# Altium schematic sheet WCcircuit.SchDoc
size A4
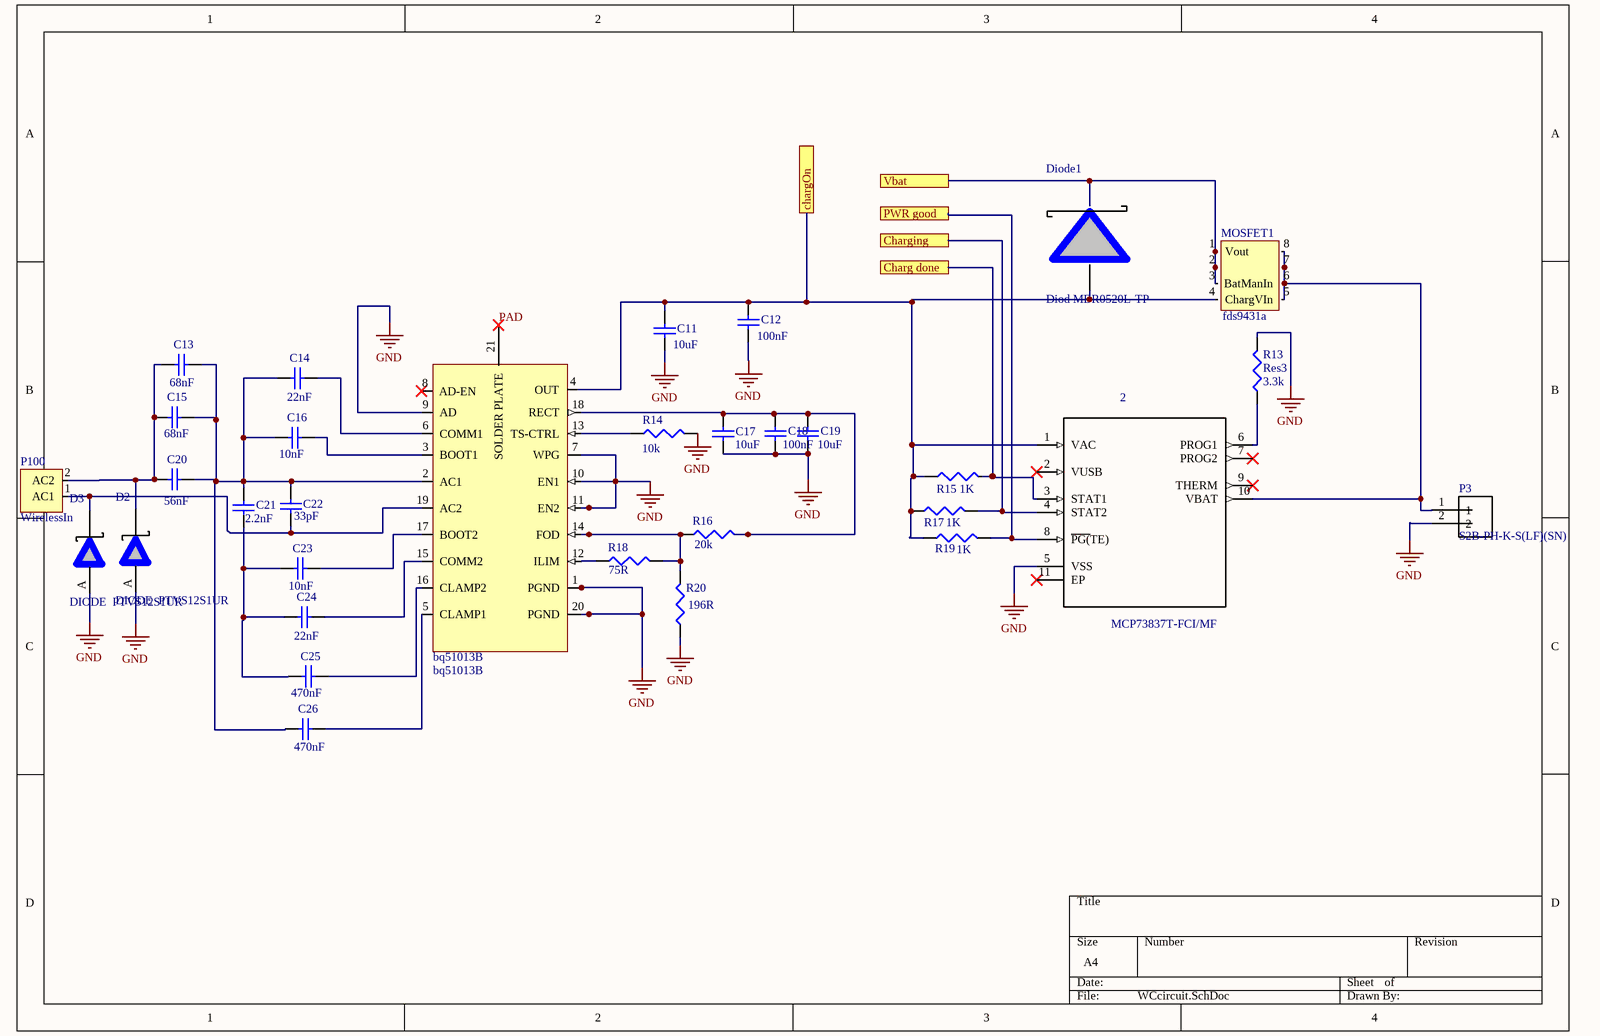
[diagram p0: WCcircuit.SchDoc]

## Parts
2  MCP73837T-FCI/MF  [DFN300X300X100-11N]
bq51013B  bq51013B  [CONTROLLER_MSP430FR2522IRHLT]
C11  value 10uF  [1608[0603]]  (hidden comment: Cap Semi)
C12  value 100nF  [1608[0603]]  (hidden comment: Cap Semi)
C13  value 68nF  [1608[0603]]  (hidden comment: Cap Semi)
C14  value 22nF  [1608[0603]]  (hidden comment: Cap Semi)
C15  value 68nF  [1608[0603]]  (hidden comment: Cap Semi)
C16  value 10nF  [1608[0603]]  (hidden comment: Cap Semi)
C17  value 10uF  [1608[0603]]  (hidden comment: Cap Semi)
C18  value 100nF  [1608[0603]]  (hidden comment: Cap Semi)
C19  value 10uF  [1608[0603]]  (hidden comment: Cap Semi)
C20  value 56nF  [1608[0603]]  (hidden comment: Cap Semi)
C21  value 2.2nF  [1608[0603]]  (hidden comment: Cap Semi)
C22  value 33pF  [1608[0603]]  (hidden comment: Cap Semi)
C23  value 10nF  [1608[0603]]  (hidden comment: Cap Semi)
C24  value 22nF  [1608[0603]]  (hidden comment: Cap Semi)
C25  value 470nF  [1608[0603]]  (hidden comment: Cap Semi)
C26  value 470nF  [1608[0603]]  (hidden comment: Cap Semi)
D2  DIODE  PTVS12S1UR  [PTVS12S1UR]
D3  DIODE  PTVS12S1UR  [PTVS12S1UR]
Diode1  Diod MBR0520L-TP  [SOD3716X135N]
MOSFET1  fds9431a  [SOIC127P600X175-8N]
P3  S2B-PH-K-S(LF)(SN)  [JST_S2B-PH-K-S(LF)(SN)]
P100  WirelessIn  [WirelessIn]
R13  Res3  value 3.3k  [J1-0603]
R14  value 10k  [J1-0603]  (hidden comment: Res3)
R15  value 1K  [J1-0603]  (hidden comment: Res3)
R16  value 20k  [J1-0603]  (hidden comment: Res3)
R17  value 1K  [J1-0603]  (hidden comment: Res3)
R18  value 75R  [J1-0603]  (hidden comment: Res3)
R19  value 1K  [J1-0603]  (hidden comment: Res3)
R20  value 196R  [J1-0603]  (hidden comment: Res3)

## Ports
Charg done, Charging, chargOn, PWR good, Vbat

## Nets
GND: 2.5(VSS) bq51013B.1(PGND) bq51013B.7(WPG) bq51013B.9(AD) bq51013B.10(EN1) bq51013B.11(EN2) bq51013B.20(PGND) C11.1 C12.1 C17.1 C18.1 C19.1 D2.A D3.A P3.2 R13.2 R14.2 R20.1
Charg done: 2.3(STAT1) R15.2 ; port Charg done
Charging: 2.4(STAT2) R17.2 ; port Charging
chargOn: 2.1(VAC) bq51013B.4(OUT) C11.2 C12.2 Diode1.A MOSFET1.4(ChargVIn) R15.1 R17.1 R19.1 ; port chargOn
PAD: bq51013B.21(SOLDER_PLATE)
PWR good: 2.8(~{PG(}TE)) R19.2 ; port PWR good
Vbat: Diode1.C MOSFET1.1(Vout) MOSFET1.2 MOSFET1.3 ; port Vbat
Net2_6: 2.6(PROG1) R13.1
Net2_10: 2.10(VBAT) MOSFET1.5 MOSFET1.6(BatManIn) MOSFET1.7 MOSFET1.8 P3.1
Netbq51013B_2: bq51013B.2(AC1) C13.2 C14.1 C15.2 C16.1 C20.2 C21.2 C22.2 C26.1
Netbq51013B_3: bq51013B.3(BOOT1) C16.2
Netbq51013B_5: bq51013B.5(CLAMP1) C26.2
Netbq51013B_6: bq51013B.6(COMM1) C14.2
Netbq51013B_12: bq51013B.12(ILIM) R18.1
Netbq51013B_13: bq51013B.13(TS-CTRL) R14.1
Netbq51013B_14: bq51013B.14(FOD) R16.1 R18.2 R20.2
Netbq51013B_15: bq51013B.15(COMM2) C24.2
Netbq51013B_16: bq51013B.16(CLAMP2) C25.2
Netbq51013B_17: bq51013B.17(BOOT2) C23.2
Netbq51013B_18: bq51013B.18(RECT) C17.2 C18.2 C19.2 R16.2
Netbq51013B_19: bq51013B.19(AC2) C22.1 D3.C P100.1(AC1)
NetC13_1: C13.1 C15.1 C20.1 D2.C P100.2(AC2)
NetC21_1: C21.1 C23.1 C24.1 C25.1

Not connected (* = marked no-connect by the designer): 2 2(VUSB)* 7(PROG2)* 9(THERM)* 11(EP)*; bq51013B 8(AD-EN)*

## Notes on the sheet
- (in symbol MCP73837T-FCI/MF) Text

## Library data of the parts
2 = MCP73837T-FCI/MF: MCP73837 Series 6 V Linear Battery Charge Controller Surface Mount - DFN-10; MF: Microchip; Package: DFN-10 Microchip; SnapEDA_Link: https://www.snapeda.com/symbols-footprints/MCP73837T-FCI/MF/Microchip/view-part/?ref=snap; MP: MCP73837T-FCI/MF; Availability: Good; Price: 0.98 USD; Value: *
C11-C26 = Cap Semi: Capacitor (Semiconductor SIM Model); Published: 8-Jun-2000; LatestRevisionDate: 29-May-2009; LatestRevisionNote: IPC-7351 Footprint Added.; PackageReference: C1206; Publisher: Altium Limited; PackageDescription: Chip Capacitor
P3 = S2B-PH-K-S(LF)(SN): Header Side Entry 2way; MF: JST; SnapEDA_Link: https://www.snapeda.com/symbols-footprints/S2B-PH-K-S%20%28LF%29%28SN%29/JST/view-part/?ref=snap; Availability: Good; Package: None; Price: 0.12 USD; MP: S2B-PH-K-S (LF)(SN); Value: *
R13-R20 = Res3: Resistor; Published: 8-Jun-2000; LatestRevisionDate: 29-May-2009; LatestRevisionNote: IPC-7351 Footprint Added.; PackageReference: J1-0603; Publisher: Altium Limited; PackageDescription: Chip Resistor